# Altium schematic sheet finalFilter.SchDoc
size A4
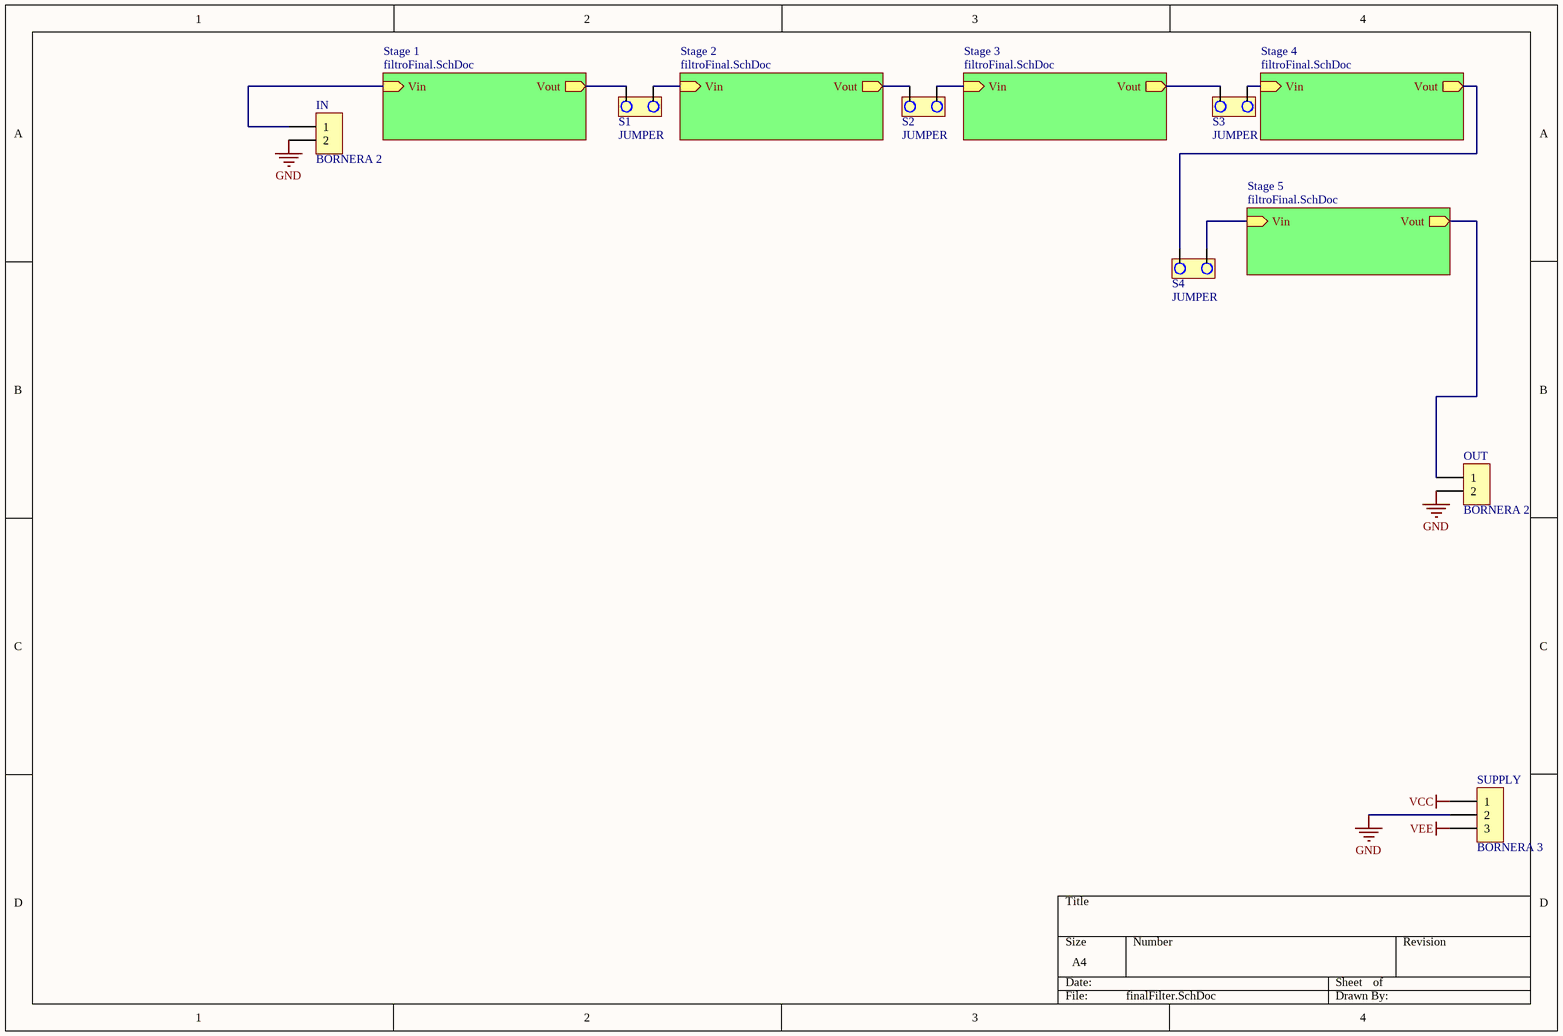
[diagram p0: finalFilter.SchDoc]

## Parts
IN  BORNERA 2  [BORNERA2]
OUT  BORNERA 2  [BORNERA2]
S1  JUMPER  [JUMPER2]
S2  JUMPER  [JUMPER2]
S3  JUMPER  [JUMPER2]
S4  JUMPER  [JUMPER2]
SUPPLY  BORNERA 3  [BORNERA3]

## Sub-sheets
Stage 1 = filtroFinal.SchDoc: Vin (in), Vout (out)
Stage 2 = filtroFinal.SchDoc: Vin (in), Vout (out)
Stage 3 = filtroFinal.SchDoc: Vin (in), Vout (out)
Stage 4 = filtroFinal.SchDoc: Vin (in), Vout (out)
Stage 5 = filtroFinal.SchDoc: Vin (in), Vout (out)

## Nets
GND: IN.2 OUT.2 SUPPLY.2
VCC: SUPPLY.1
VEE: SUPPLY.3
NetIN_1: IN.1 ; sheet Stage 1/Vin
NetOUT_1: OUT.1 ; sheet Stage 5/Vout
NetS1_1: S1.1 ; sheet Stage 1/Vout
NetS1_2: S1.2 ; sheet Stage 2/Vin
NetS2_1: S2.1 ; sheet Stage 2/Vout
NetS2_2: S2.2 ; sheet Stage 3/Vin
NetS3_1: S3.1 ; sheet Stage 3/Vout
NetS3_2: S3.2 ; sheet Stage 4/Vin
NetS4_1: S4.1 ; sheet Stage 4/Vout
NetS4_2: S4.2 ; sheet Stage 5/Vin